# EAGLE design radio_am_fm_ta2003 (EAGLE 9.6.2)
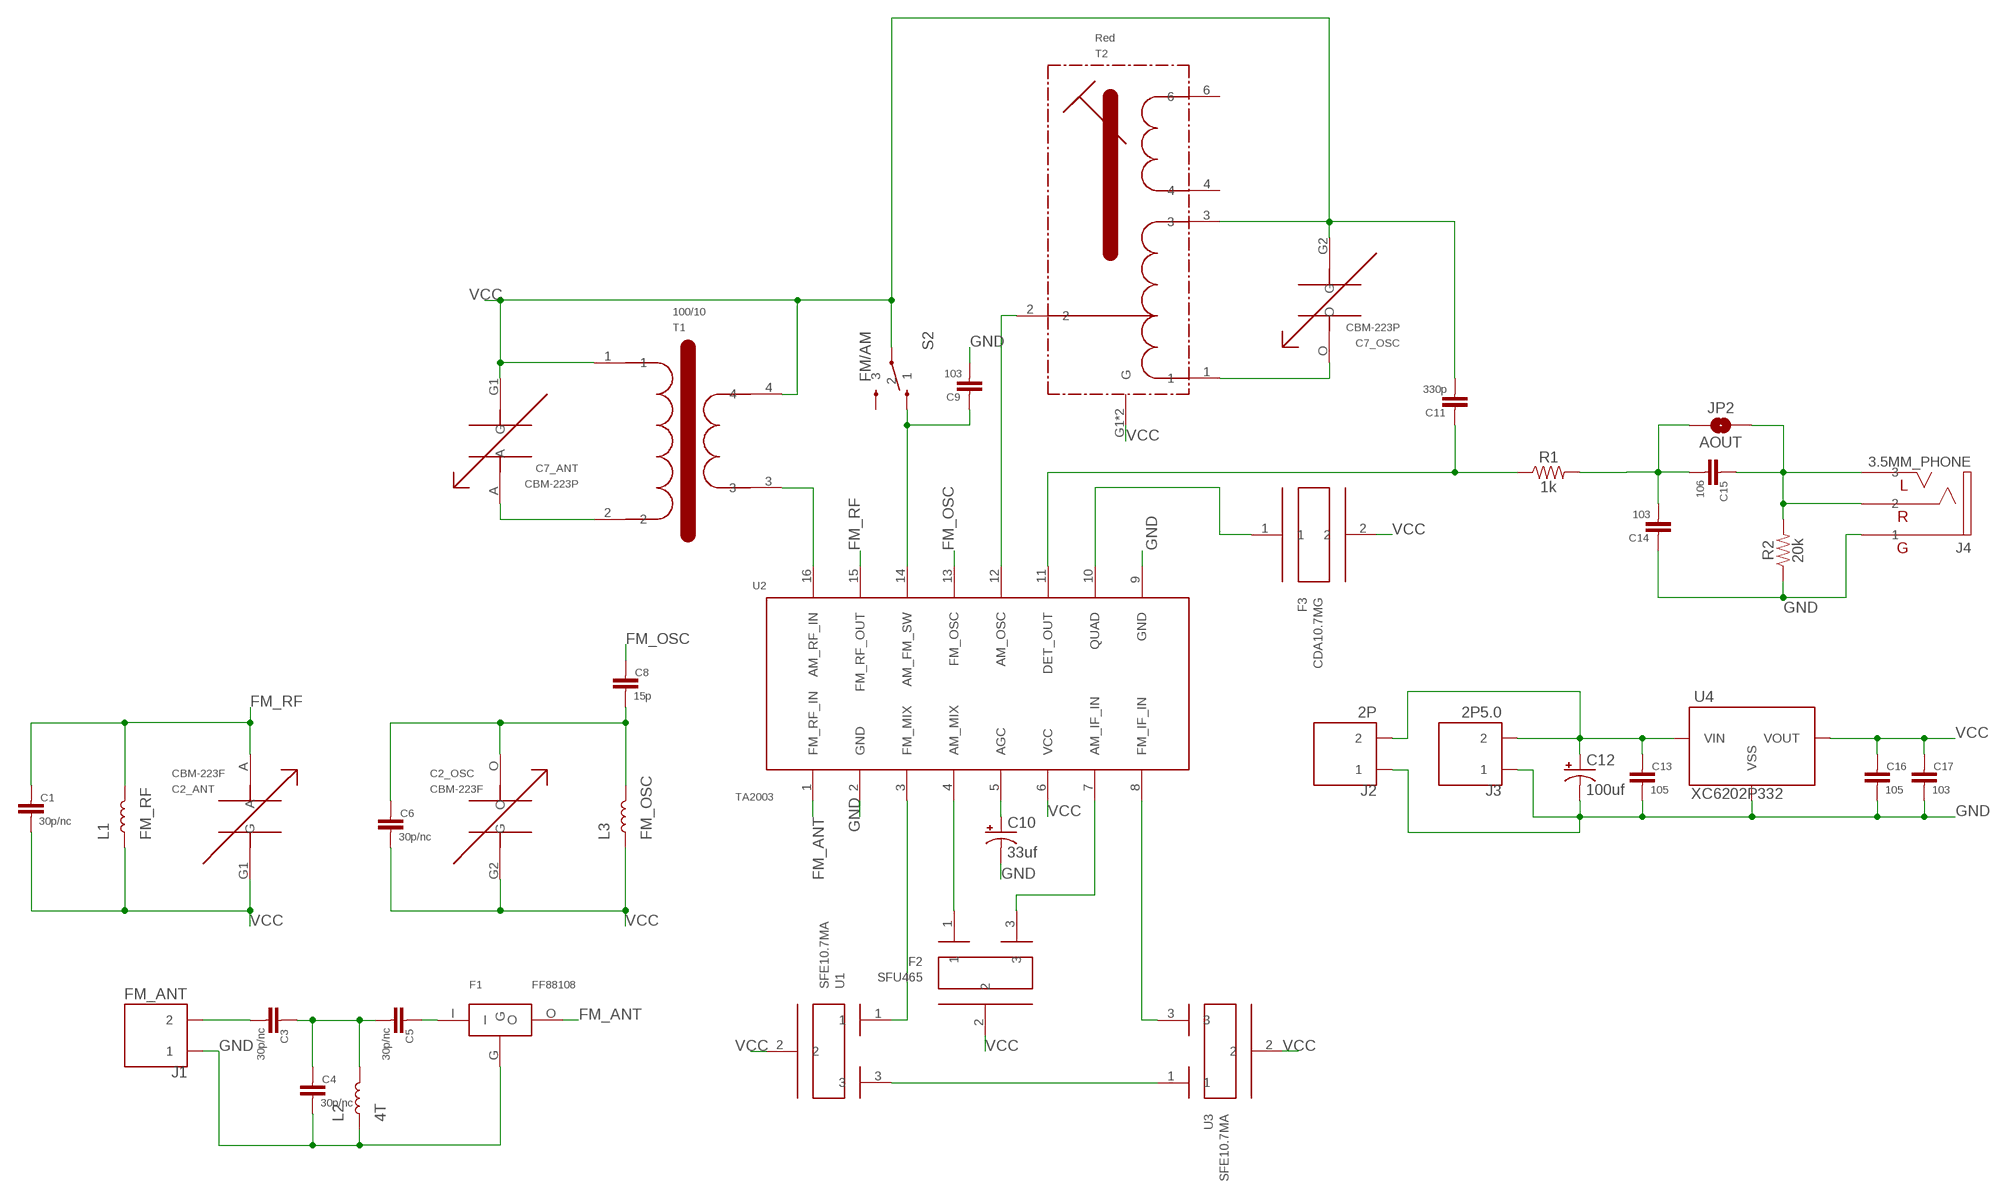
[diagram p0: schematic, sheet 1]

## Parts
C1  30p/nc  CAP_SMDC0603  [C0603]
C2  CBM-223F  [CBM-223P]
C3  30p/nc  CAP_SMDC0603  [C0603]
C4  30p/nc  CAP_SMDC0603  [C0603]
C5  30p/nc  CAP_SMDC0603  [C0603]
C6  30p/nc  CAP_SMDC0603  [C0603]
C7  CBM-223P  [CBM-223P]
C8  15p  CAP_SMDC0603  [C0603]
C9  103  CAP_SMDC0603  [C0603]
C10  33uf  CAP2MM  [CAP_2MM]
C11  330p  CAP_SMDC0603  [C0603]
C12  100uf  CAP  [CAP_2.5MM]
C13  105  CAP_SMDC0603  [C0603]
C14  103  CAP_SMDC0603  [C0603]
C15  106  CAP_SMDC0603  [C0603]
C16  105  CAP_SMDC0603  [C0603]
C17  103  CAP_SMDC0603  [C0603]
F1  FF88108  [FF88108]
F2  SFU465  [SFU465]
F3  CDA10.7MG  [CDA10.7MG]
J1  FM_ANT  2P  [2P_2.54MM]
J2  2P  [2P_2.54MM]
J3  2P5.0  [2P_5.08MM]
J4  3.5MM_PHONE  [3.5MM]
JP2  AOUT  JUMPER-SMT_2_NO_SILK  [SMT-JUMPER_2_NO_SILK]
L1  FM_RF  INDUCTOR_PTH  [VLU0810]
L2  4T  INDUCTOR_PTH  [VLU0810]
L3  FM_OSC  INDUCTOR_PTH  [VLU0810]
R1  1k  RESISTOR_SMDR0603  [R0603]
R2  20k  RESISTOR_SMDR0603  [R0603]
S2  FM/AM  KEY_SPDT  [L12.1_W5.6]
T1  100/10  AM_ANT_COIL  [AM_ANT_COIL]
T2  Red  ZX920  [42IF1XX]
U1  SFE10.7MA  [SFE10.7MA]
U2  TA2003  [DIP16]
U3  SFE10.7MA  [SFE10.7MA]
U4  XC6202P332  XC6202  [SOT-23-3]

## Nets
FM_ANT: F1.O U2.1(FM_RF_IN)
FM_OSC: C8.1 U2.13(FM_OSC)
FM_OSC1: C2.O C6.1 C8.2 L3.-
FM_RF: C1.1 C2.A L1.- U2.15(FM_RF_OUT)
GND: C4.2 C9.2 C10.- C12.- C13.2 C14.1 C16.2 C17.2 F1.G J1.1 J2.1 J3.L J4.P$1 L2.+ R2.1 U2.2(GND) U2.9(GND) U4.3(VSS)
N$1: C7.O T2.1
N$2: T1.3 U2.16(AM_RF_IN)
N$3: C7.A T1.2
N$4: T2.2 U2.12(AM_OSC)
N$5: C11.1 R1.1 U2.11(DET_OUT)
N$6: C9.1 S2.1 U2.14(AM_FM_SW)
N$7: C10.+ U2.5(AGC)
N$8: F2.1 U2.4(AM_MIX)
N$9: F2.3 U2.7(AM_IF_IN)
N$10: U1.1 U2.3(FM_MIX)
N$11: U2.8(FM_IF_IN) U3.3
N$12: C15.1 J4.P$2 J4.P$3 JP2.2 R2.2
N$13: U1.3 U3.1
N$14: F3.1 U2.10(QUAD)
N$15: C3.1 C4.1 C5.2 L2.-
N$16: C3.2 J1.2
N$17: C14.2 C15.2 JP2.1 R1.2
N$18: C5.1 F1.I
N$19: C12.+ C13.1 J2.2 J3.N U4.2(VIN)
VCC: C1.2 C2.G1(G) C2.G2(G) C6.2 C7.G1(G) C7.G2(G) C11.2 C16.1 C17.1 F2.2 F3.2 L1.+ L3.+ S2.2 T1.1 T1.4 T2.3 T2.G1(G) T2.G2(G) U1.2 U2.6(VCC) U3.2 U4.1(VOUT)
Unconnected: S2.3 T2.4 T2.6

## Library data of the parts
C1 C3-C6 C8 C9 C11 C13-C17 = Capacitors:CAP_SMD
C2 = RF:CBM-223F
C7 = RF:CBM-223P
C10 C12 = Capacitors:CAP
F1 = RF:FF88108
F2 = PTH:SFU465
F3 = PTH:CDA10.7MG
J1-J3 = Jumpers:2P
J4 = Connectors:3.5MM_PHONE: 描述： 类型：3.5mm耳机插口 接口：三段式 连接：https://item.szlcsc.com/19296.html
JP2 = SparkFun-Jumpers:JUMPER-SMT_2_NO: Normally open jumper This jumper has two pads in close proximity to each other. Apply solder to close the connection. Round pads are easier to solder for beginners, but are a lot larger. SparkFun Product that uses the round pads: SparkFun EL Sequencer <https://www.sparkfun.com/products/12781>
L1-L3 = Coils:INDUCTOR_PTH: 描述： 名称：电感 VLU0810-102K 参数：1000uH ±10% 封装：8*10 链接：https://item.szlcsc.com/73738.html
R1 R2 = Resistors:RESISTOR_SMD
S2 = Switches:KEY_SPDT
T1 = RF:AM_ANT_COIL
T2 = RF:ZX920
U1 U3 = PTH:SFE10.7MA
U2 = IC_Comms:TA2003
U4 = IC_Power:XC6202: 描述： 类型：3.3V固定输出LDO 型号：XC6202 封装：sot23-3 温度：-40~85度 链接：https://item.szlcsc.com/48379.html

## Board
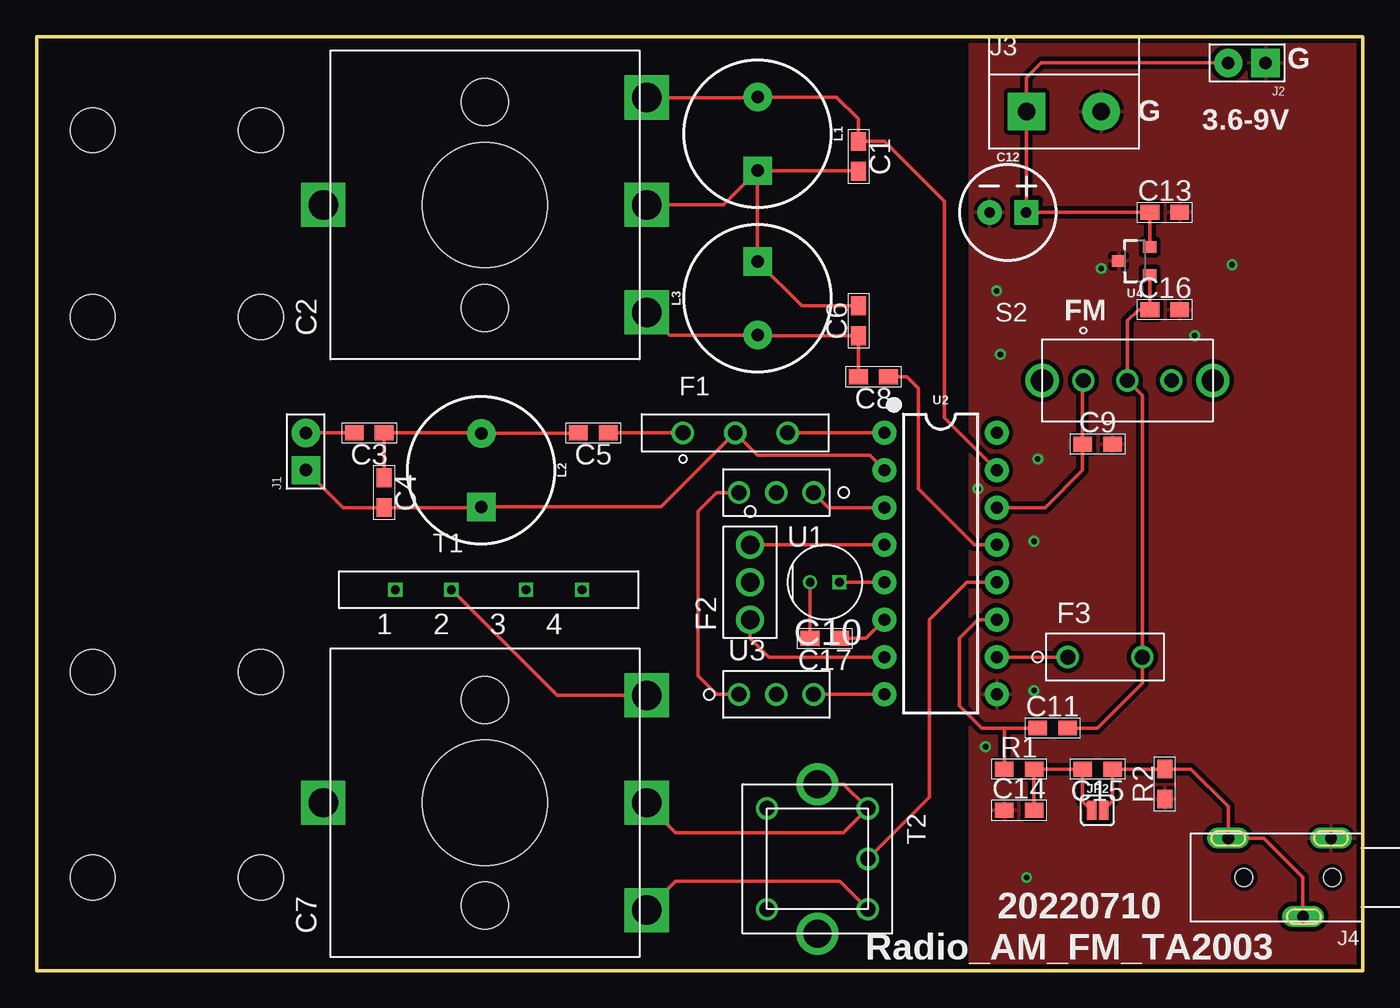
[diagram p1: board, top side]
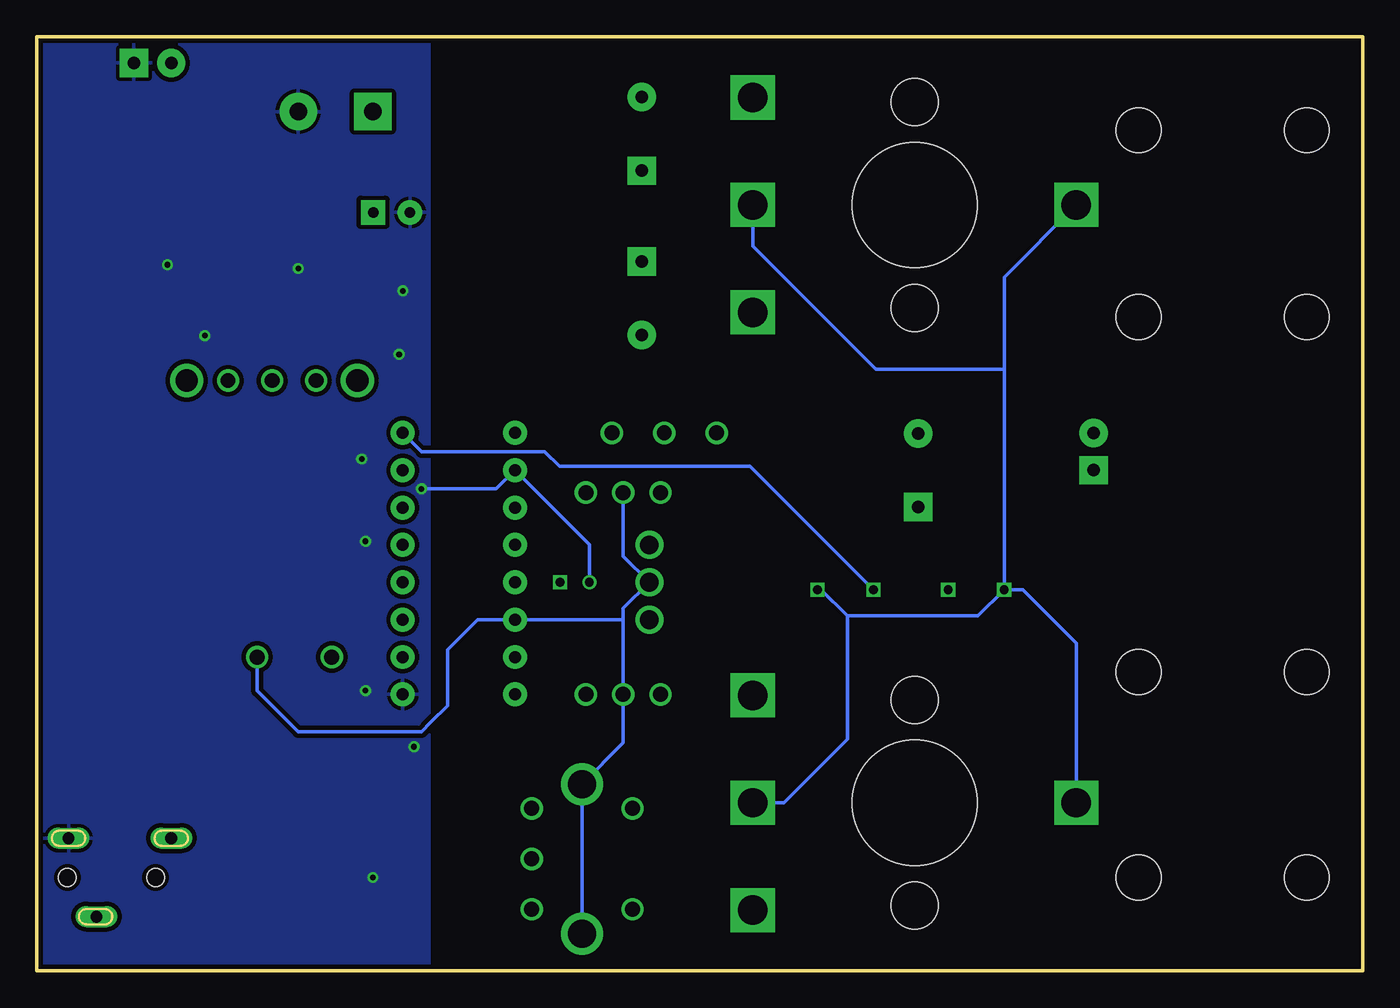
[diagram p2: board, bottom side, seen from below]

Size 90.17 x 63.5 mm. Coordinates in mm from the lower left corner, seen from the top.
Outline: 0,0 0,63.5 90.17,63.5 90.17,0 0,0
Copper layers (1*16): Top 0.035mm / dielectric 1.5mm / Bottom 0.035mm
Design rules "SparkFun-2-Layer-General-JLCPCB": minimum track width 7mil, minimum drill 0.3mm, track to track 7mil, track to pad 7mil, pad to pad 7mil, via to via 7mil, smd to smd 7mil, copper to edge 7mil, drill to drill 7mil, minimum pad ring 7mil, minimum via ring 7mil, stop-mask expansion 3mil, vias tented up to drill 25mil, thermal gap 10mil
Holes 3.05 mm at 3.81,57.15 15.24,57.15 3.81,44.45 15.24,44.45 3.81,20.32 15.24,20.32 3.81,6.35 15.24,6.35

### Footprints (pad centres in the part's own frame; a part is rotated, then mirrored left to right if it is on the bottom)
C0603 = smd 1.27 x 1.016: 1 -1.016,0; 2 1.016,0
CBM-223P = drill 2 square: A 7.3,-11; G1 0,-11; G2 0,11; O -7.3,-11 | hole 8.5: 0,0 | hole 3.2: -7,0; 7,0
CAP_2MM = drill 0.6 square: + -1,0 | drill 0.6: - 1,0
CAP_2.5MM = drill 0.7 pad 1.651 square: + 1.25,0 | drill 0.7 pad 1.651: - -1.25,0
FF88108 = drill 1.016: G 0,0; I -3.556,0; O 3.556,0
SFU465 = drill 1.27: 1 2.54,0; 2 0,0; 3 -2.54,0
CDA10.7MG = drill 1.016: 1 -2.54,0; 2 2.54,0
2P_2.54MM = drill 0.85 pad 1.93 square: 1 0,0 | drill 0.85 pad 1.93: 2 2.54,0
2P_5.08MM = drill 1.2 pad 2.54: L 5.08,0 | drill 1.2 pad 2.54 square: N 0,0
3.5MM = drill 0.8 pad 1.422 long: P$1 -2.921,-2.667; P$2 -1.016,2.667; P$3 4.064,-2.667 | hole 1.2: -3,0; 3,0
SMT-JUMPER_2_NO_SILK = smd 0.635 x 1.27: 1 -0.406,0; 2 0.406,0
VLU0810 = drill 0.85 pad 1.93 square: + 2.5,0 | drill 0.85 pad 1.93: - -2.5,0
R0603 = smd 1.27 x 1.016: 1 -1.016,0; 2 1.016,0
L12.1_W5.6 = drill 1: 1 -3,0; 2 0,0; 3 3,0 | drill 1.5: P$4 -5.8,0; P$5 5.8,0
AM_ANT_COIL = drill 0.6 square: 1 -6.35,0; 2 -2.54,0; 3 2.54,0; 4 6.35,0
42IF1XX = drill 1.016: 1 3.429,3.429; 2 0,3.429; 3 -3.429,3.429; 4 -3.429,-3.429; 6 3.429,-3.429 | drill 1.905: G1 -5.08,0; G2 5.08,0
SFE10.7MA = drill 1.016: 1 -2.54,0; 2 0,0; 3 2.54,0
DIP16 = drill 0.813 pad 1.626: 1 -8.89,-3.81; 2 -6.35,-3.81; 3 -3.81,-3.81; 4 -1.27,-3.81; 5 1.27,-3.81; 6 3.81,-3.81; 7 6.35,-3.81; 8 8.89,-3.81; 9 8.89,3.81; 10 6.35,3.81; 11 3.81,3.81; 12 1.27,3.81; 13 -1.27,3.81; 14 -3.81,3.81; 15 -6.35,3.81; 16 -8.89,3.81
SOT-23-3 = smd 0.9 x 0.8: 1 1,-0.95; 2 1,0.95; 3 -1.1,0

### Placement (x,y rotation side)
C1  55.88,55.37 270 top
C2  30.48,52.07 90 top
C3  22.61,36.58 180 top
C4  23.62,32.51 270 top
C5  37.85,36.58 180 top
C6  55.88,44.2 90 top
C7  30.48,11.43 90 top
C8  56.9,40.39 180 top
C9  72.14,35.81 0 top
C10  53.59,26.42 180 top
C11  69.09,16.51 0 top
C12  66.04,51.56 0 top
C13  76.71,51.56 0 top
C14  66.8,10.92 0 top
C15  72.14,13.72 180 top
C16  76.71,44.96 0 top
C17  53.59,22.61 180 top
F1  47.5,36.58 0 top
F2  48.51,26.42 90 top
F3  72.64,21.34 0 top
J1  18.29,34.04 90 top
J2  83.57,61.72 180 top
J3  67.31,58.42 0 top
J4  85.09,6.35 180 top
JP2  72.14,10.92 0 top
L1  49.02,56.9 270 top
L2  30.23,34.04 270 top
L3  49.02,45.72 90 top
R1  66.8,13.72 0 top
R2  76.71,12.7 90 top
S2  74.17,40.13 0 top
T1  30.73,25.91 0 top
T2  53.09,7.62 270 top
U1  50.29,32.51 180 top
U2  61.47,27.69 270 top
U3  50.29,18.8 0 top
U4  74.68,48.26 0 top

### Tracks (layer width: path | path; a pad name or v marks a point on that pad's centre or on a via)
FM_ANT
  Top 0.254: F1.O U2.1
FM_OSC
  Top 0.254: U2.13 63.75,28.96 59.94,32.77 59.94,39.62 59.18,40.39 C8.1
FM_OSC1
  Top 0.254: C2.O 43.03,43.22 L3.- 49.06,43.18 C6.1 C8.2
FM_RF
  Top 0.254: C2.A 49,59.37 L1.- 54.4,59.4 55.88,57.91 C1.1 57.66,56.39 61.72,52.32 61.72,37.59 U2.15
GND  (via drill 0.38)
  Top 0.254: C17.2 52.58,26.4 C10.- | J1.1 20.83,31.5 C4.2 30.19,31.5 L2.+ 42.46,31.54 F1.G 49.02,35.05 56.64,35.05 U2.2
  Bottom 0.254: C10.- 52.59,28.97 U2.2 58.93,32.77 v64.01,32.77
  other vias: 78.74,43.18 67.31,6.35 67.82,19.05 67.82,29.21 68.07,34.8 65.53,41.91 65.28,46.23 72.39,47.75 64.52,15.24 81.28,48.01
  pour Bottom (isolate 0.305): 63.5,0 63.5,63.5 90.17,63.5 90.17,0
  pour Top (isolate 0.305): 63.5,0 63.5,63.5 90.17,63.5 90.17,0
N$1
  Top 0.254: C7.O 43.45,6.1 54.61,6.1 T2.1
N$2
  Bottom 0.254: T1.3 41.66,34.29 54.61,34.29 55.63,35.31 64.01,35.31 U2.16
N$3
  Top 0.254: C7.A 35.37,18.73 T1.2
N$4
  Top 0.254: T2.2 60.71,11.81 60.71,23.88 63.25,26.42 U2.12
N$5
  Top 0.254: U2.11 64.01,23.88 62.74,22.61 62.74,18.03 64.26,16.51 65.79,16.51 | C11.1 65.79,16.51 | R1.1 65.79,16.51
N$6
  Top 0.254: U2.14 68.58,31.5 71.12,34.04 C9.1 71.12,40.08 S2.1
N$7
  Top 0.254: U2.5 C10.+
N$8
  Top 0.254: U2.4 F2.1
N$9
  Top 0.254: U2.7 49.78,21.34 48.51,22.61 F2.3
N$10
  Top 0.254: U2.3 53.85,31.5 U1.1
N$11
  Top 0.254: U3.3 U2.8
N$12
  Top 0.254: JP2.2 73.15,11.53 C15.1 R2.2 78.49,13.72 81.03,11.18 J4.P$3 83.44,9.02 86.11,6.35 J4.P$2
N$13
  Top 0.254: U1.3 46.23,32.51 44.96,31.24 44.96,20.07 46.23,18.8 U3.1
N$14
  Top 0.254: U2.10 F3.1
N$15
  Top 0.254: C5.2 36.79,36.54 L2.- 30.19,36.58 C3.1 C4.1
N$16
  Top 0.254: J1.2 C3.2
N$17
  Top 0.254: C14.2 R1.2 C15.2 71.12,11.53 JP2.1
N$18
  Top 0.254: C5.1 F1.I
N$19
  Top 0.254: U4.2 75.69,49.23 C13.1 C12.+ 67.31,51.58 J3.N 67.31,60.71 68.33,61.72 J2.2
VCC
  Top 0.254: C2.G1 46.7,52.07 L1.+ | C6.2 52.03,45.21 L3.+ L1.+ | L1.+ 55.84,54.4 C1.2 | C11.2 72.14,16.51 75.18,19.56 F3.2 75.18,39.12 S2.2 74.17,44.2 74.93,44.96 C16.1 75.69,47.29 U4.1 | C17.1 56.39,22.61 U2.6 | C7.G1 41.48,11.35 43.43,9.4 54.86,9.4 T2.3 54.86,12.7 T2.G1
  Bottom 0.254: T1.4 36.83,25.91 35.05,24.13 | 35.05,24.13 26.16,24.13 T1.1 | C7.G2 19.48,22.27 23.11,25.91 T1.1 | T1.1 24.38,40.89 | 24.38,40.89 24.38,41.66 24.38,47.17 C2.G2 | 50.29,23.88 U3.2 50.29,15.49 T2.G1 T2.G2 | 50.29,23.88 50.29,24.64 F2.2 50.29,28.19 U1.2 | 50.29,23.88 U2.6 60.2,23.88 62.23,21.84 62.23,18.03 63.37,16.89 64.01,16.26 72.39,16.26 75.18,19.05 F3.2 | C7.G1 39.37,11.43 35.05,15.75 35.05,24.13 | C2.G1 41.48,49.28 33.1,40.89 24.38,40.89

### Text on the board
tPlace: G | G | 3.6-9V | FM | 1 2 3 4 | 20220710 | Radio_AM_FM_TA2003